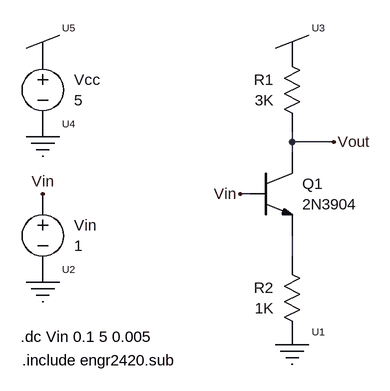
[diagram p0: schematic inverter.asc]
inverter.asc, the LTspice schematic file:
Version 4
SHEET 1 880 680
WIRE 368 96 368 80
WIRE 432 96 368 96
WIRE 368 112 368 96
WIRE 304 176 288 176
WIRE 368 272 368 240
FLAG 288 176 Vin
FLAG -16 176 Vin
FLAG 432 96 Vout
SYMBOL cktsym\\resistor 368 16 R180
WINDOW 3 28 -16 Left 0
WINDOW 0 28 16 Left 0
SYMATTR Value 3K
SYMATTR InstName R1
SYMBOL cktsym\\npn 368 176 R0
SYMATTR Value 2N3904
SYMATTR InstName Q1
SYMBOL cktsym\\gnd 368 400 R0
SYMATTR InstName U1
SYMBOL cktsym\\vsource -16 240 R0
SYMATTR Value 1
SYMATTR InstName Vin
SYMBOL cktsym\\gnd -16 304 R0
SYMATTR InstName U2
SYMBOL cktsym\\vdd 368 -48 R0
SYMATTR InstName U3
SYMBOL cktsym\\resistor 368 336 R180
WINDOW 3 28 -16 Left 0
WINDOW 0 28 16 Left 0
SYMATTR Value 1K
SYMATTR InstName R2
SYMBOL cktsym\\vsource -16 16 R0
SYMATTR Value 5
SYMATTR InstName Vcc
SYMBOL cktsym\\gnd -16 80 R0
SYMATTR InstName U4
SYMBOL cktsym\\vdd -16 -48 R0
SYMATTR InstName U5
TEXT -50 396 Left 0 !.dc Vin 0.1 5 0.005
TEXT -48 432 Left 0 !.include engr2420.sub

The netlist it stands for:
* inverter.asc
R1 Vout P001 3K
Q1 Vout Vin N001 0 2N3904
XU1 P002 gnd  ; pins GND
Vin Vin P003 1
XU2 P003 gnd  ; pins GND
XU3 P001 vdd  ; pins VDD
R2 P002 N001 1K
Vcc P004 P005 5
XU4 P005 gnd  ; pins GND
XU5 P004 vdd  ; pins VDD
.model NPN NPN
.model PNP PNP
.lib standard.bjt
.dc Vin 0.1 5 0.005
.include engr2420.sub
.backanno
.end